# EasyEDA Pro project DCDC.eprj, board Buck
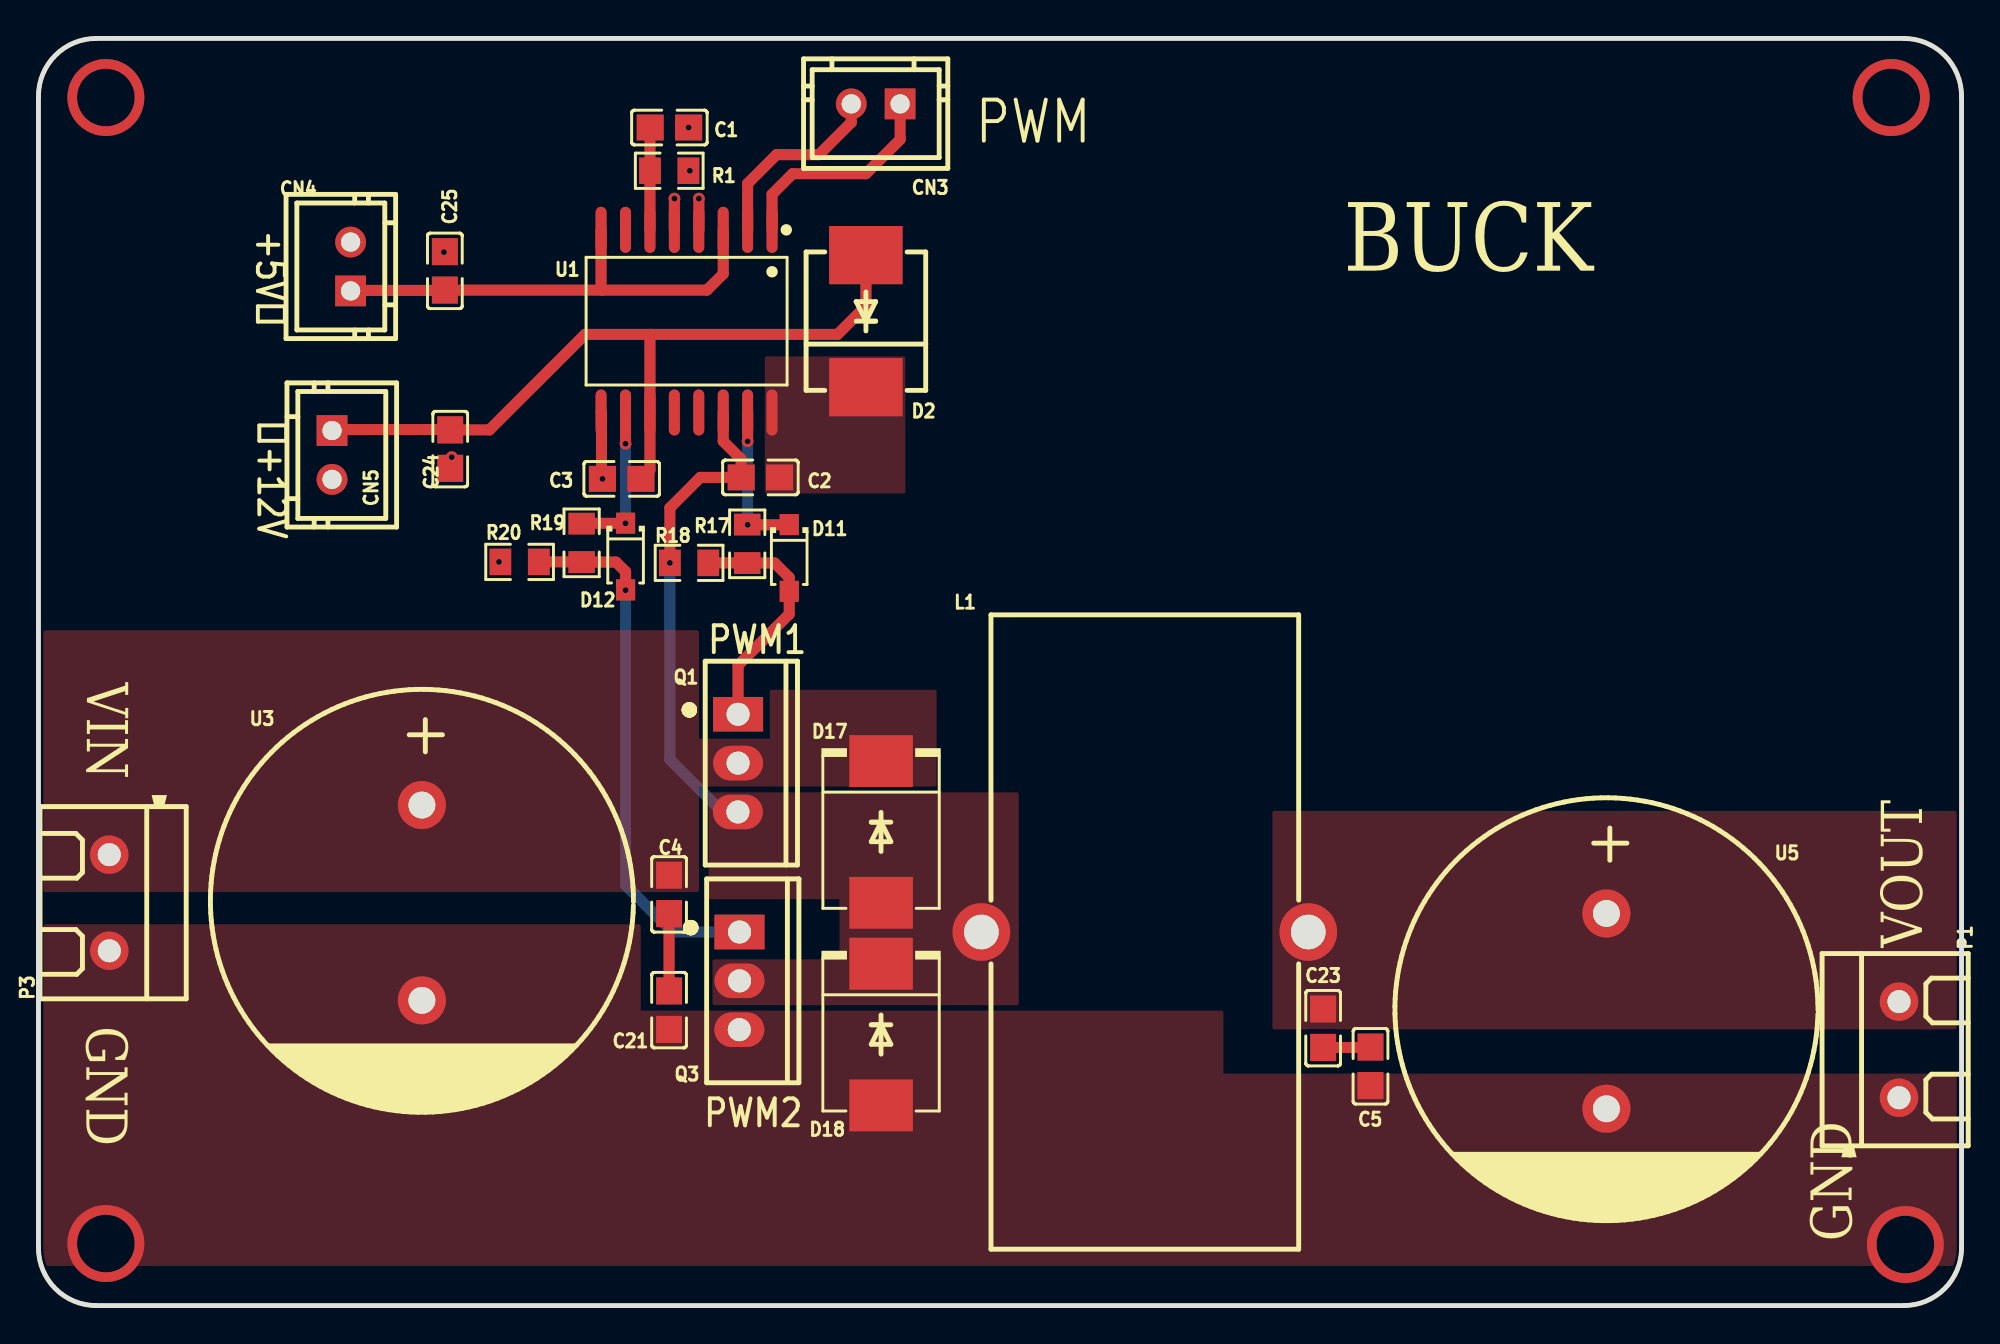
[diagram p8: board, top side]
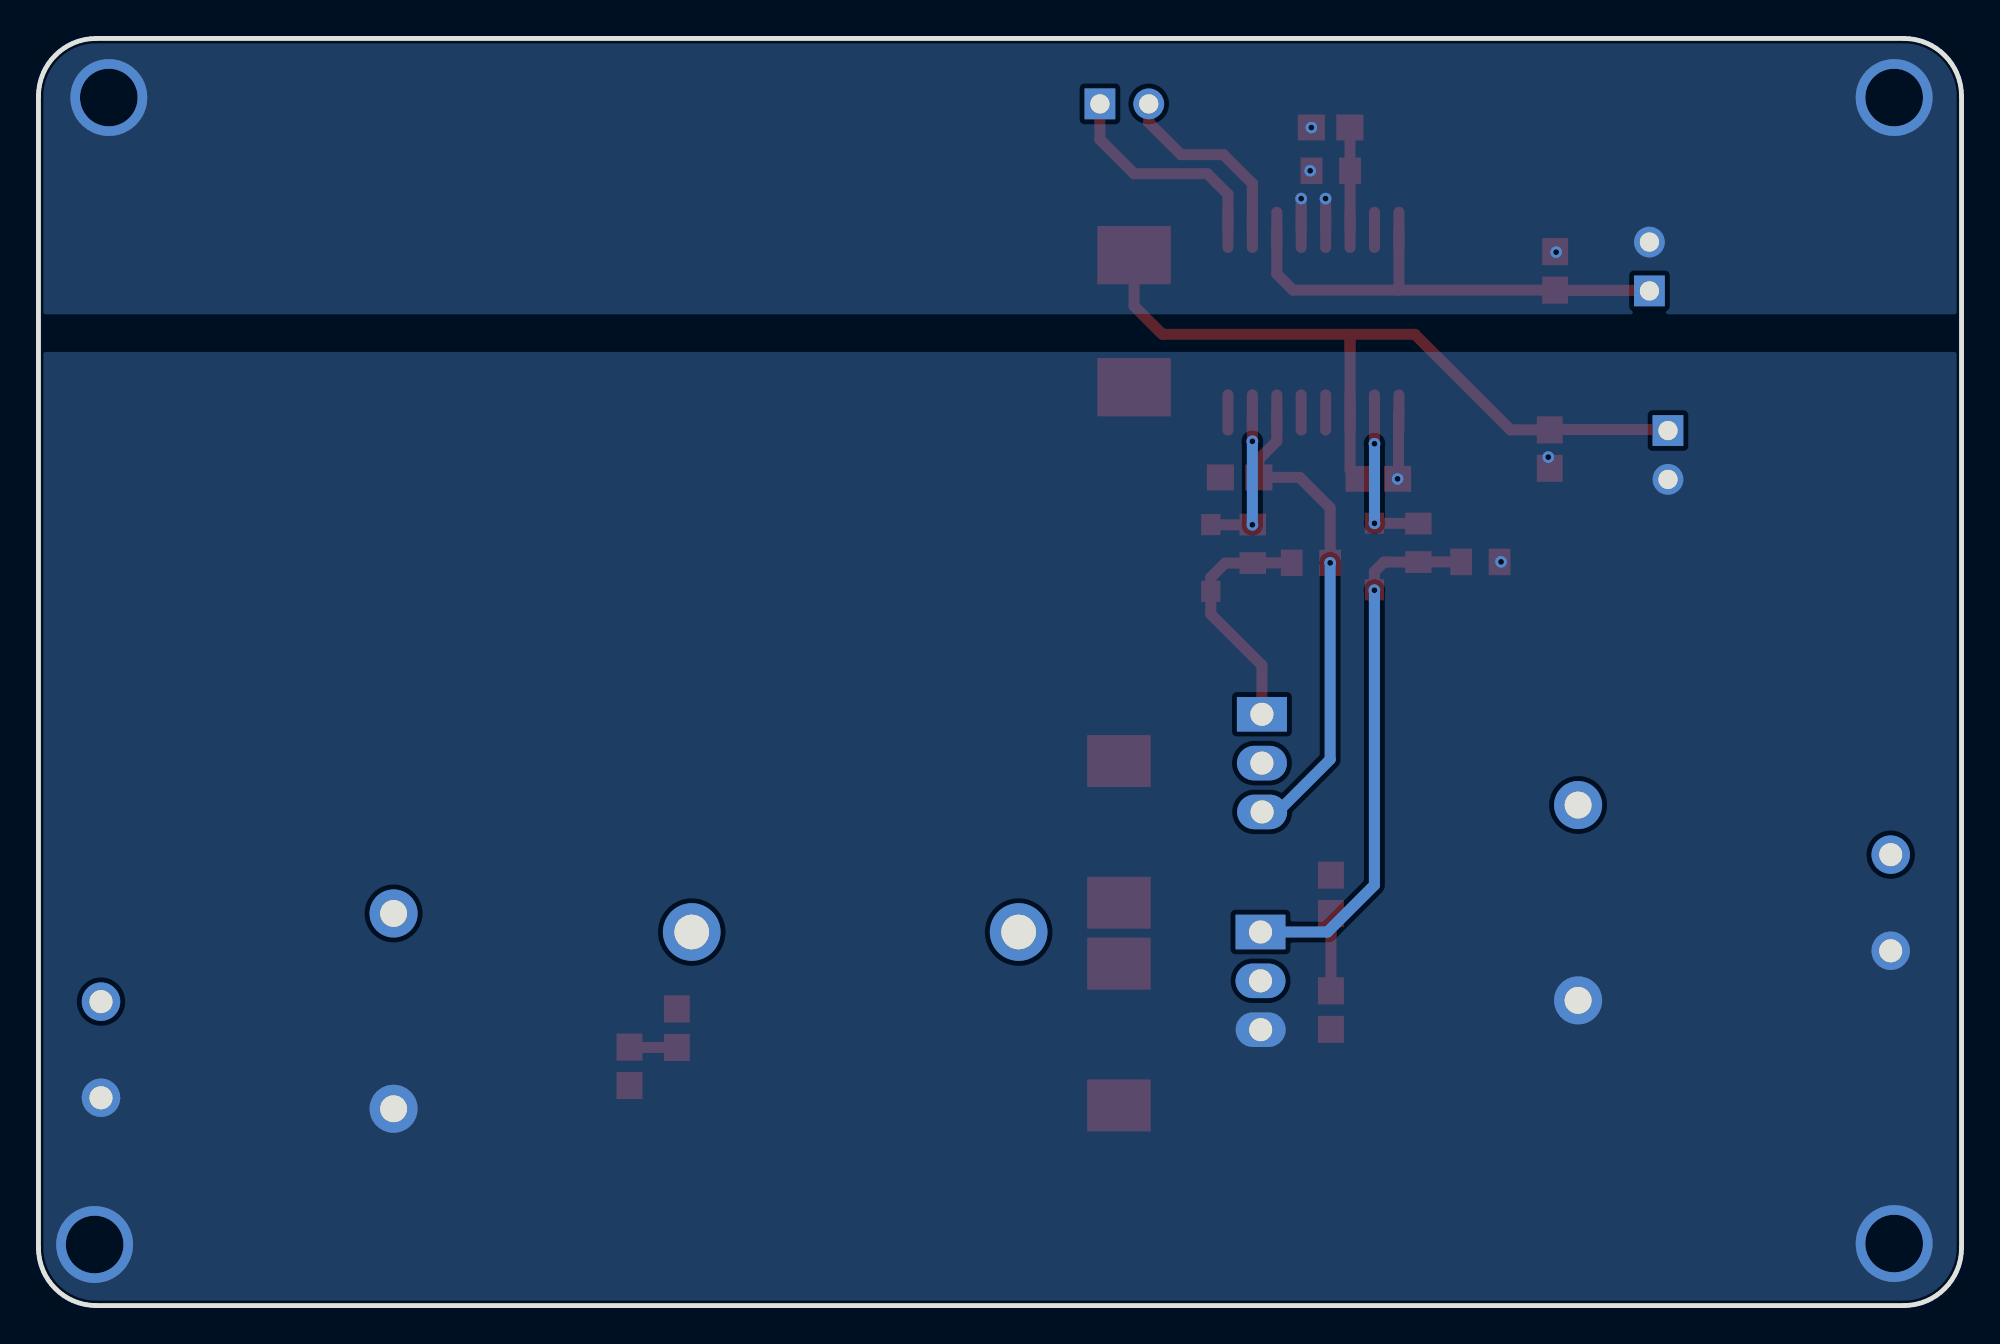
[diagram p9: board, bottom side, seen from below]

Outline 100 x 65.91 mm; copper layers: Top Layer, Bottom Layer. Coordinates in mm from the lower left corner of the outline.
Outline path: 0,62.91 0,3 arc(0.88,0.88) 3,0 97,0 arc(99.12,0.88) 100,3 100,62.91 arc(99.12,65.03) 97,65.91 3,65.91 arc(0.88,65.03) 0,62.91
Stack: Top Layer 0.035mm / Dielectric1 1.51mm FR4 er 4.5 / Bottom Layer 0.035mm

## Design rules (mm)
template: 自定义配置
spacing copperThickness1oz (default): track to track 0.102, other pairs 0.152 to 0.3
spacing copperThickness2oz: track to track 0.203, other pairs 0.152 to 0.3
track width copperThickness1oz (default): min 0.127, default 0.254, max 2.54
track width copperThickness2oz: min 0.203, default 0.254, max 2.54
differential pair differentialPair (default): width min 0.127, default 0.254, max 2.54; gap min 0.152, default 0.152
via viaSize (default): diameter min 0.5, default 0.61, max 10; hole min 0.3, default 0.305, max 6.3

## Placement (name value [footprint] x y rotation side)
C1  100nF  [C0805]  32.81 61.28 180 top
C2  1uF  [C0805]  37.54 43.08 0 top
C3  1uF  [C0805]  30.33 43 0 top
C4  100nF  [C0805]  32.79 21.39 90 top
C5  100nF  [C0805]  69.27 12.45 90 top
C21  100nF  [C0805]  32.79 15.37 90 top
C23  100nF  [C0805]  66.8 14.43 90 top
C24  10uF  [C0805]  21.41 44.55 90 top
C25  10uF  [C0805]  21.13 53.82 270 top
CN3  CON2-2.54*2P  [CONN-TH_2P-P2.54-V]  43.54 62.51 180 top
CN4  CON2-2.54*2P  [CONN-TH_2P-P2.54-V]  16.23 54.05 90 top
CN5  CON2-2.54*2P  [CONN-TH_2P-P2.54-V]  15.27 44.25 270 top
D2  RS3MC  [SMC_L7.1-W6.2-LS8.1-R-RD]  43.03 51.21 90 top
D11  1N4148W  [SOD-123F_L2.7-W1.6-LS3.8-RD]  39.04 38.89 270 top
D12  1N4148W  [SOD-123F_L2.7-W1.6-LS3.8-RD]  30.53 38.96 270 top
D17  SK1010C  [SMC_L6.9-W5.9-LS7.9-RD]  43.81 24.64 270 top
D18  SK1010C  [SMC_L6.9-W5.9-LS7.9-RD]  43.81 14.1 270 top
L1  47uH  [IND-TH_L33.0-W16.0-P17.00-D1.5]  57.53 19.43 0 top
P1  KF301-2P接线端子  [CONN-TH_XY301V-A-5.0-2P]  96.75 13.31 270 top
P3  KF301-2P接线端子  [CONN-TH_XY301V-A-5.0-2P]  3.68 20.96 90 top
Q1  CSD19536KCS  [TO-220-3_L10.0-W4.5-P2.54-L]  36.38 28.22 270 top
Q3  CSD19536KCS  [TO-220-3_L10.0-W4.5-P2.54-L]  36.45 16.89 270 top
R1  5.1K  [R0805]  32.8 59.03 180 top
R17  2  [R0805]  36.86 39.62 270 top
R18  10K  [R0805]  33.83 38.63 0 top
R19  2  [R0805]  28.24 39.68 270 top
R20  10K  [R0805]  25.02 38.68 0 top
U1  UCC21520DWR  [SOIC-16_L10.3-W7.5-P1.27-LS10.3-BL]  33.7 51.21 180 top
U3  2200uF  [CAP-TH_BD22.0-P10.00-D1.4-FD]  19.94 20.96 270 top
U5  2200uF  [CAP-TH_BD22.0-P10.00-D1.4-FD]  81.53 15.32 270 top

## Footprints (pads in the part's own frame, mm; a bottom-side part is the same pattern mirrored in y, then rotated)
C0805
  rect 1.41x1.35 smd: 1(-1,0) 2(1,0)
CAP-TH_BD22.0-P10.00-D1.4-FD
  round 2.5 hole 1.4: 1(-5.08,0) 2(5.08,0)
CONN-TH_2P-P2.54-V
  rect 1.6x1.6 hole 1: 1(-1.27,0)
  round 1.6 hole 1: 2(1.27,0)
CONN-TH_XY301V-A-5.0-2P
  round 2 hole 1.2: 1(-2.5,0) 2(2.5,0)
IND-TH_L33.0-W16.0-P17.00-D1.5
  round 3 hole 1.8: 1(-8.5,0) 2(8.5,0)
R0805
  rect 1.133x1.377 smd: 1(-1,0) 2(1,0)
SMC_L6.9-W5.9-LS7.9-RD
  rect 2.7x3.3 smd: 1(-3.687,0) 2(3.687,0)
SMC_L7.1-W6.2-LS8.1-R-RD
  rect 3.03x3.82 smd: 1(3.435,0) 2(-3.435,0)
SOD-123F_L2.7-W1.6-LS3.8-RD
  rect 1.1x1 smd: 1(-1.735,0) 2(1.735,0)
SOIC-16_L10.3-W7.5-P1.27-LS10.3-BL
  oval 0.574x2.401 smd: 1(-4.445,-4.75) 2(-3.175,-4.75) 3(-1.905,-4.75) 4(-0.635,-4.75) 5(0.635,-4.75) 6(1.905,-4.75) 7(3.175,-4.75) 8(4.445,-4.75) 9(4.445,4.75) 10(3.175,4.75) 11(1.905,4.75) 12(0.635,4.75) 13(-0.635,4.75) 14(-1.905,4.75) 15(-3.175,4.75) 16(-4.445,4.75)
TO-220-3_L10.0-W4.5-P2.54-L
  rect 1.8x2.6 hole 1.2: 1(-2.54,0.005)
  oval 1.8x2.6 hole 1.2: 2(0,0.005) 3(2.54,-0.005)

## Nets
As in the schematic.

Pads without a net: U1 7 12 13

## Via types
v1: diameter 0.61, hole 0.305, Top Layer to Bottom Layer, 14 vias
v2: diameter 4, hole 3, Top Layer to Bottom Layer, 4 vias

## Routing (per net, layer and track width the routed paths; a pad name or vN(x,y) marks a point on that pad's centre or on a via; arc(x,y) is an arc through that point)
+5V: length 25.5
  Top Layer w0.574: 20.85,52.45 20.85,52.81 16.59,52.81 16.18,52.4 ; U1.3 35.61,53.67 34.76,52.82 29.34,52.82 ; 29.34,52.82 C25.2 ; 29.34,52.82 29.26,52.91 U1.8
+12V: length 40.9
  Top Layer w0.574: C24.2 23.45,45.55 28.42,50.52 31.86,50.52 ; D2.1 43.03,51.99 41.55,50.52 31.86,50.52 ; 31.86,50.52 31.8,50.46 U1.11 31.8,43.47 C3.2 ; 21.41,45.83 21.11,45.83 20.84,45.57 15.32,45.57 CN5.1
AGND: length 2.8
  Top Layer w0.574: 29.28,43.66 29.28,46.44 U1.9
  vias: v1(21.49,44.13) v1(23.95,38.68) v1(29.33,43) v2(3.5,3.23) v2(97.08,3.18)
DGND: length 3.3
  Top Layer w0.574: U1.4 34.34,55.96 v1(34.34,57.58) ; v1(33.07,57.58) 33.07,57.58 U1.5
  vias: v1(21.08,54.8) v1(33.81,61.28) v1(33.87,59.03) v2(3.5,62.84) v2(96.34,62.84)
VSS: length 25.9
  Top Layer w0.574: v1(32.83,38.63) 32.83,41.49 34.42,43.08 C2.1 36.54,44.03 35.61,44.96 U1.14
  Bottom Layer w0.574: v1(32.83,38.63) 32.83,28.41 35.56,25.68 Q1.3
A: length 8
  Top Layer w0.574: U1.15 v1(36.88,44.96) ; D11.1 39.03,40.61 v1(36.88,40.61)
  Bottom Layer w0.574: v1(36.88,44.96) v1(36.88,40.61)
B: length 8.1
  Top Layer w0.574: U1.10 v1(30.53,44.83) ; v1(30.53,40.69) 28.26,40.69 R19.1
  Bottom Layer w0.574: v1(30.53,44.83) v1(30.53,40.69)
H: length 12.7
  Top Layer w0.574: R18.2 36.85,38.63 R17.2 38.29,38.62 39.04,37.87 D11.2 39.04,35.97 36.38,33.31 Q1.1
L: length 28
  Top Layer w0.574: R20.2 28.24,38.68 R19.2 30.03,38.68 30.53,38.18 D12.2 v1(30.53,37.21)
  Bottom Layer w0.574: Q3.1 32.97,19.43 30.53,21.87 v1(30.53,37.21)
PWM1: length 11.5
  Top Layer w0.574: U1.1 38.15,57.81 39.22,58.88 43.03,58.88 44.81,60.66 CN3.1
PWM2: length 10.1
  Top Layer w0.574: CN3.2 42.27,61.54 40.59,59.87 38.38,59.87 36.88,58.37 U1.2
$1N5580: length 4
  Top Layer w0.574: C4.1 C21.2
$1N6266: length 2.5
  Top Layer w0.574: C23.1 69.25,13.43 C5.2
$1N8133: length 5.3
  Top Layer w0.574: C1.2 31.8,61.27 R1.2 31.8,59.03 U1.6

## Copper pours and planes (outline as drawn; the poured copper is in the pictures)
AGND on Top Layer: -0.13,2.06 -0.13,19.84 31.32,19.84 31.32,15.34 61.62,15.34 61.62,12.07 100.03,12.07 100.03,2.06
AGND on Bottom Layer: -0.61,49.61 100.48,49.61 100.48,-0.56 -0.61,-0.56
DGND on Bottom Layer: -0.84,66.55 100.53,66.55 100.53,51.56 -0.84,51.56
VIN on Top Layer: 34.34,27.01 34.34,21.51 -0.25,21.51 -0.25,35.13 34.34,35.13 34.34,29.49 38.02,29.49 38.02,32.03 46.71,32.03 46.71,27.01
VSS on Top Layer: 50.98,15.62 35.05,15.62 35.05,18.01 41.66,18.01 41.66,21.13 34.85,21.13 34.85,26.7 50.98,26.7
VOUT on Top Layer: 64.16,25.73 100.05,25.73 100.05,14.37 64.16,14.37
$1N8142 on Top Layer: 37.77,49.38 45.09,49.38 45.09,42.24 37.77,42.24

## Text on the board
Top Silkscreen Layer: PWM2 | PWM1 | PWM | +5V⬆ | ⬆+12V | GND | VOUT | VIN | BUCK
